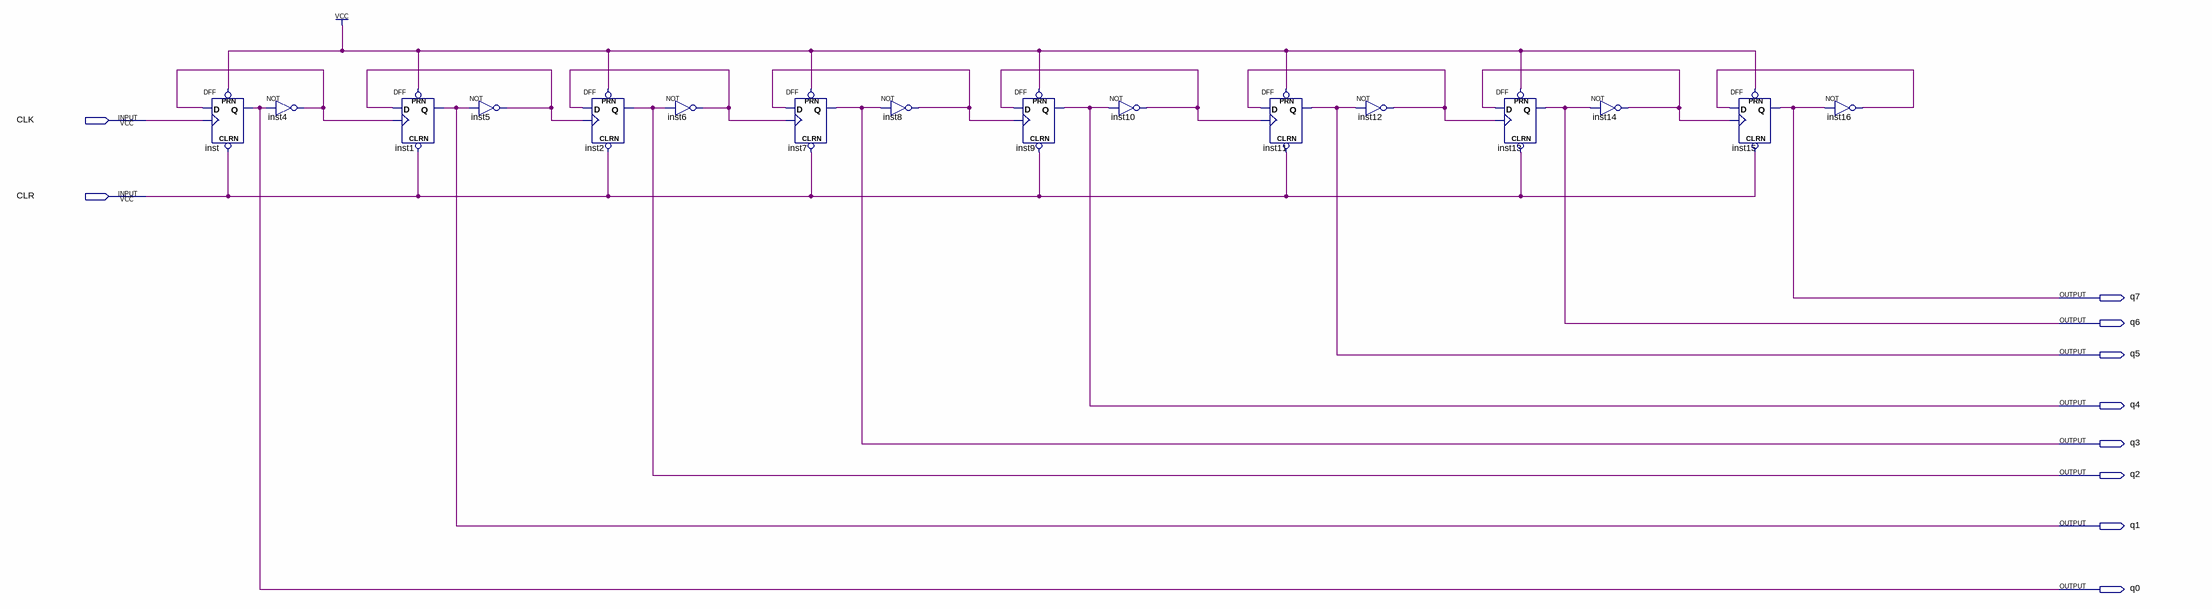
[diagram p0: schematic sheet]
// Quartus schematic yibumo256jia1.bdf as structural Verilog: 16 symbols, 10 pins
module yibumo256jia1 (
  input  CLK,
  input  CLR,
  output q7,
  output q6,
  output q5,
  output q4,
  output q3,
  output q2,
  output q1,
  output q0
);

  wire inst4_out, inst5_out, inst6_out, inst8_out, inst10_out, inst12_out, inst14_out, inst16_out;

  DFF inst (.CLRN(CLR), .CLK(CLK), .D(inst4_out), .PRN(1'b1), .Q(q0));
  not inst4 (inst4_out, q0);
  DFF inst1 (.CLRN(CLR), .CLK(inst4_out), .D(inst5_out), .PRN(1'b1), .Q(q1));
  not inst5 (inst5_out, q1);
  DFF inst2 (.CLRN(CLR), .CLK(inst5_out), .D(inst6_out), .PRN(1'b1), .Q(q2));
  not inst6 (inst6_out, q2);
  DFF inst7 (.CLRN(CLR), .CLK(inst6_out), .D(inst8_out), .PRN(1'b1), .Q(q3));
  not inst8 (inst8_out, q3);
  DFF inst9 (.CLRN(CLR), .CLK(inst8_out), .D(inst10_out), .PRN(1'b1), .Q(q4));
  not inst10 (inst10_out, q4);
  DFF inst11 (.CLRN(CLR), .CLK(inst10_out), .D(inst12_out), .PRN(1'b1), .Q(q5));
  not inst12 (inst12_out, q5);
  DFF inst13 (.CLRN(CLR), .CLK(inst12_out), .D(inst14_out), .PRN(1'b1), .Q(q6));
  not inst14 (inst14_out, q6);
  DFF inst15 (.CLRN(CLR), .CLK(inst14_out), .D(inst16_out), .PRN(1'b1), .Q(q7));
  not inst16 (inst16_out, q7);
endmodule
